# Altium schematic sheet PULL.SchDoc
size A4
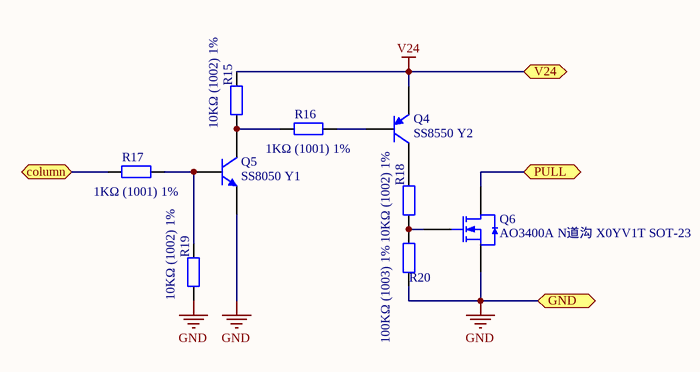
[diagram p0: PULL.SchDoc]

## Parts
Q4  SS8550 Y2  [SOT-23(SOT-23-3)]
Q5  SS8050 Y1  [SOT-23(SOT-23-3)]
Q6  AO3400A N道沟 X0YV1T SOT-23  [SOT-23-3L]
R15  10KΩ (1002) 1%  [0805_R]
R16  1KΩ (1001) 1%  [0805_R]
R17  1KΩ (1001) 1%  [0805_R]
R18  10KΩ (1002) 1%  [0805_R]
R19  10KΩ (1002) 1%  [0805_R]
R20  100KΩ (1003) 1%  [0805_R]

## Ports
column, GND, PULL, V24

## Nets
GND: Q5.2(E) Q6.2(S) R19.1 R20.2 ; port GND
V24: Q4.2(E) R15.2 ; port V24
column: R17.2 ; port column
PULL: Q6.3(D) ; port PULL
NetQ4_1: Q4.1(B) R16.1
NetQ4_3: Q4.3(C) R18.2
NetQ5_1: Q5.1(B) R17.1 R19.2
NetQ5_3: Q5.3(C) R15.1 R16.2
NetQ6_1: Q6.1(G) R18.1 R20.1

## Library data of the parts
Q4 = SOT-23 SS8550 Y2: 三极管; ComponentLink1Description: 供应商链接; ComponentLink1URL: http://www.szlcsc.com/product/details_9037.html; Package: SOT-23; Supplier: LC; SuppliersPartNumber: C8542
Q5 = SOT-23 SS8050 Y1: 三极管; ComponentLink1Description: 供应商链接; ComponentLink1URL: http://www.szlcsc.com/product/details_2507.html; Package: SOT-23; Supplier: LC; SuppliersPartNumber: C2150
Q6 = AO3400A N道沟 X0YV1T SOT-23: MOS(场效应管); ComponentLink1Description: 供应商链接; ComponentLink1URL: http://www.szlcsc.com/product/details_21629.html; Package: SOT-23; Supplier: LC; SuppliersPartNumber: C20917
R15 R18 R19 = 0805 10KΩ (1002) 1%: 贴片电阻; ComponentLink1Description: 供应商链接; ComponentLink1URL: http://www.szlcsc.com/product/details_18102.html; Package: 0805; Supplier: LC; SuppliersPartNumber: C17414
R16 R17 = 0805 1KΩ (1001) 1%: 贴片电阻; ComponentLink1Description: 供应商链接; ComponentLink1URL: http://www.szlcsc.com/product/details_18201.html; Package: 0805; Supplier: LC; SuppliersPartNumber: C17513
R20 = 0805 100KΩ (1003) 1%: 贴片电阻; ComponentLink1Description: 供应商链接; ComponentLink1URL: http://www.szlcsc.com/product/details_18095.html; Package: 0805; Supplier: LC; SuppliersPartNumber: C17407